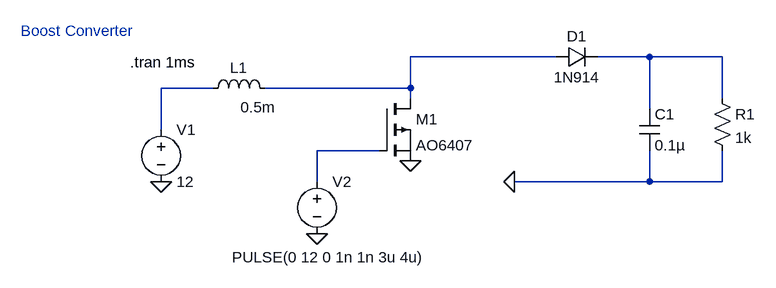
[diagram p0: schematic Boost_converter.asc]
Boost_converter.asc, the LTspice schematic file:
Version 4
SHEET 1 880 680
WIRE 432 64 208 64
WIRE 576 64 496 64
WIRE 688 64 576 64
WIRE -96 112 -176 112
WIRE 208 112 208 64
WIRE 208 112 -16 112
WIRE 208 128 208 112
WIRE 688 128 688 64
WIRE 576 144 576 64
WIRE -176 176 -176 112
WIRE 160 208 64 208
WIRE 64 256 64 208
WIRE 576 256 576 208
WIRE 576 256 368 256
WIRE 688 256 688 208
WIRE 688 256 576 256
FLAG -176 256 0
FLAG 368 256 0
FLAG 64 336 0
FLAG 208 224 0
SYMBOL diode 432 80 R270
WINDOW 0 32 32 VTop 2
WINDOW 3 0 32 VBottom 2
SYMATTR InstName D1
SYMATTR Value 1N914
SYMBOL ind -112 128 R270
WINDOW 0 32 56 VTop 2
WINDOW 3 2 85 VBottom 2
SYMATTR InstName L1
SYMATTR Value 0.5m
SYMBOL cap 560 144 R0
SYMATTR InstName C1
SYMATTR Value 0.1µ
SYMBOL res 672 112 R0
SYMATTR InstName R1
SYMATTR Value 1k
SYMBOL voltage -176 160 R0
SYMATTR InstName V1
SYMATTR Value 12
SYMBOL voltage 64 240 R0
WINDOW 3 -131 132 Left 2
WINDOW 123 0 0 Left 0
WINDOW 39 0 0 Left 0
SYMATTR InstName V2
SYMATTR Value PULSE(0 12 0 1n 1n 3u 4u)
SYMBOL pmos 160 128 R0
SYMATTR InstName M1
SYMATTR Value AO6407
TEXT -224 72 Left 2 !.tran 1ms
TEXT -392 24 Left 2 ;Boost Converter

The netlist it stands for:
* Boost_converter.asc
D1 N001 N002 1N914
L1 N003 N001 0.5m
C1 N002 0 0.1µ
R1 N002 0 1k
V1 N003 0 12
V2 N004 0 PULSE(0 12 0 1n 1n 3u 4u)
M1 N001 N004 0 0 AO6407
.model D D
.lib standard.dio
.model NMOS NMOS
.model PMOS PMOS
.lib standard.mos
.tran 1ms
* Boost Converter
.backanno
.end